# Altium schematic sheet Main.SchDoc: Bluetooth Sentinel
size 152 x 76 mm
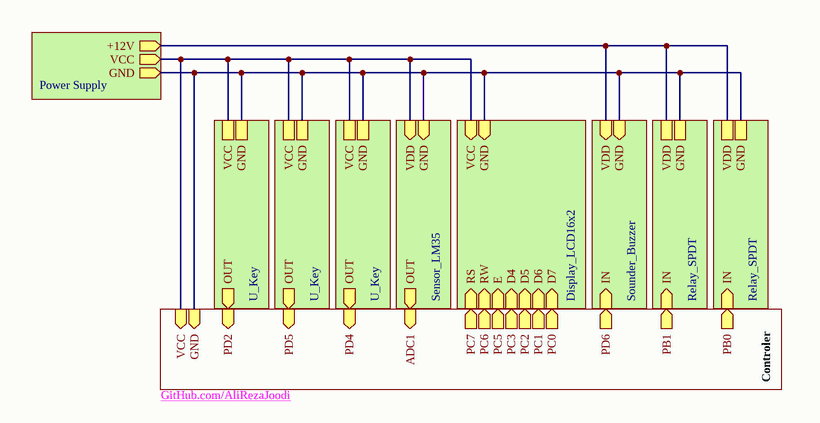
[diagram p0: Main.SchDoc]

## Sub-sheets
Controler = Controler.SchDoc: VCC (in), GND (in), PD2 (in), PD5 (in), PD4 (in), PC7 (out), PC6 (out), PC5 (out), PC3 (out), PC2 (out), PC1 (out), PC0 (out), PD6 (out), PB0 (out), PB1 (out), ADC1 (in)
Display_LCD16x2 = Display_LCD16x2: D7 (in), D6 (in), D5 (in), D4 (in), E (in), RW (in), RS (in), GND (in), VCC (in)
Sounder_Buzzer = Sounder_Buzzer: IN (in), GND (in), VDD (in)
U_Key = Key_Pull-Up: OUT (out), GND, VCC
U_Key = Key_Pull-Up: OUT (out), GND, VCC
U_Key = Key_Pull-Up: OUT (out), GND, VCC
U_Power Supply = Power Supply: VCC (out), GND (out), +12V (out)
U_Relay_SPDT = Relay_SPDT: IN (in), GND, VDD
U_Relay_SPDT = Relay_SPDT: IN (in), GND, VDD
U_Sensor_LM35 = Sensor_LM35: VDD (in), OUT (out), GND (in)

## Nets
(unnamed): sheet Controler/VCC, sheet Display_LCD16x2/VCC, sheet U_Sensor_LM35/VDD, sheet U_Power Supply/VCC, sheet U_Key/VCC, sheet U_Key/VCC, sheet U_Key/VCC
(unnamed): sheet Controler/GND, sheet Display_LCD16x2/GND, sheet Sounder_Buzzer/GND, sheet U_Sensor_LM35/GND, sheet U_Power Supply/GND, sheet U_Relay_SPDT/GND, sheet U_Relay_SPDT/GND, sheet U_Key/GND, sheet U_Key/GND, sheet U_Key/GND
(unnamed): sheet Controler/PD2, sheet U_Key/OUT
(unnamed): sheet Controler/PD5, sheet U_Key/OUT
(unnamed): sheet Controler/PD4, sheet U_Key/OUT
(unnamed): sheet Controler/PC7, sheet Display_LCD16x2/RS
(unnamed): sheet Controler/PC6, sheet Display_LCD16x2/RW
(unnamed): sheet Controler/PC5, sheet Display_LCD16x2/E
(unnamed): sheet Controler/PC3, sheet Display_LCD16x2/D4
(unnamed): sheet Controler/PC2, sheet Display_LCD16x2/D5
(unnamed): sheet Controler/PC1, sheet Display_LCD16x2/D6
(unnamed): sheet Controler/PC0, sheet Display_LCD16x2/D7
(unnamed): sheet Controler/PD6, sheet Sounder_Buzzer/IN
(unnamed): sheet Controler/PB0, sheet U_Relay_SPDT/IN
(unnamed): sheet Controler/PB1, sheet U_Relay_SPDT/IN
(unnamed): sheet Controler/ADC1, sheet U_Sensor_LM35/OUT
(unnamed): sheet Sounder_Buzzer/VDD, sheet U_Power Supply/+12V, sheet U_Relay_SPDT/VDD, sheet U_Relay_SPDT/VDD

## Notes on the sheet
- GitHub.com/AliRezaJoodi
- Sheet Title
- Project Title
- Size:
- Date:
- A4
- Item:
- Time:
- Revision:
- Sheet
- of
- File: